# Altium schematic sheet power_supply.SchDoc
size A4; SheetNumber: 3; SheetTotal: 4
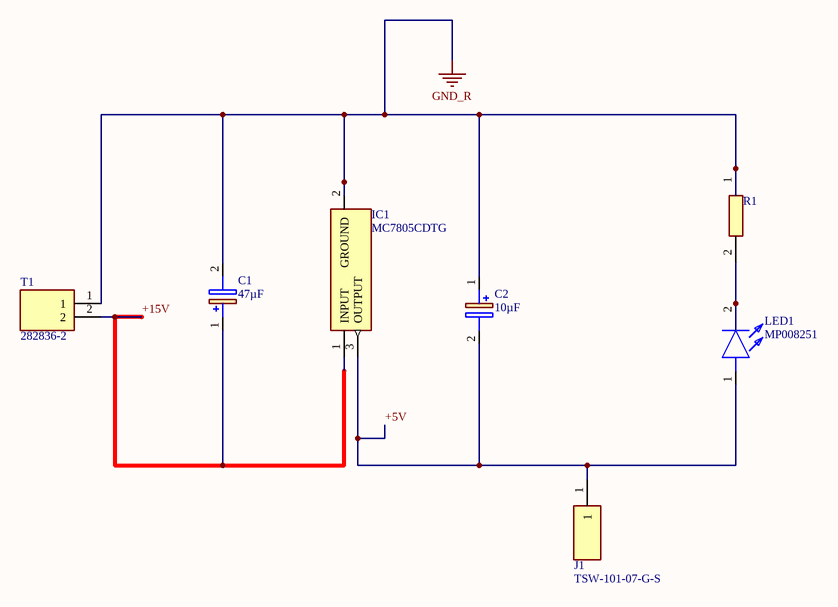
[diagram p0: power_supply.SchDoc]

## Parts
C1  value 47µF  [CAPAE1030X1050N]  (hidden comment: UUX2A470MNL1GS)
C2  value 10µF  [CAPPM6032X280N]  (hidden comment: TPSC106K025R0500)
IC1  MC7805CDTG  [MC7915ACD2TG]
J1  TSW-101-07-G-S  [TSW-101-XX-YY-S]
LED1  MP008251  [SM0603SRC]
R1  CRCW2010100KFKEF  [RESC5025X71N]  (value not drawn)
T1  282836-2  [2828362]

## Nets
GND_R: C1.2(-) C2.1(+) IC1.2(GROUND) R1.1 T1.1
+5V: C2.2(-) IC1.3(OUTPUT) J1.1 LED1.1(A)
+15V: C1.1(+) IC1.1(INPUT) T1.2
NetLED1_2: LED1.2(K) R1.2

## Library data of the parts
C1 = CMP-001-00092-1: Capacitor, Radial / Can - SMD, 47 µF, / 100 V, 2000 hours / @ 105°C, Polar Surface Mount / Tantalum; Manufacturer_Name: Nichicon; Component Type: Standard; Manufacturer_Part_Number: UUX2A470MNL1GS; Arrow Part Number: UUX2A470MNL1GS; Design Item ID: UUX2A470MNL1GS; Height: 10.5mm; Pins: 2; Arrow Price/Stock: https://www.arrow.com/en/products/uux2a470mnl1gs/nichicon; Mouser Part Number: 647-UUX2A470MNL1GS; Mouser Price/Stock: https://www.mouser.co.uk/ProductDetail/Nichicon/UUX2A470MNL1GS?qs=jZZh9D7uMhmPZMofMKn2Fg%3D%3D; Source: Schlib1.SchLib; Datasheet Link: https://componentsearchengine.com/Datasheets/1/UUX2A470MNL1GS.pdf
C2 = CMP-001-00091-1: Capacitor, 10 µF, / 25 V, 2312 [6032 / Metric], ± 10%, 0.5 / ohm, C; Manufacturer_Name: AVX; Pins: 2; Datasheet Link: https://componentsearchengine.com/Datasheets/2/TPSC106K025R0500.pdf; Manufacturer_Part_Number: TPSC106K025R0500; Component Type: Standard; Arrow Part Number: TPSC106K025R0500; Mouser Price/Stock: https://www.mouser.co.uk/ProductDetail/AVX/TPSC106K025R0500?qs=xw8XwkEH2YWjgnPlag1OVw%3D%3D; Design Item ID: TPSC106K025R0500; Arrow Price/Stock: https://www.arrow.com/en/products/tpsc106k025r0500/avx?region=nac; Height: 2.8mm; Source: Schlib1.SchLib; Mouser Part Number: 581-TPSC106K025R0500
IC1 = CMP-031-00039-1: Integrated Circuit; Manufacturer_Name: onsemi; Mouser Part Number: 863-MC7805CDTG; Arrow Price/Stock: https://www.arrow.com/en/products/mc7805cdtg/on-semiconductor?region=europe; Datasheet Link: https://www.onsemi.com/pdf/datasheet/mc7800-d.pdf; Source: RIL_SCH.SchLib; Arrow Part Number: MC7805CDTG; Mouser Price/Stock: https://www.mouser.co.uk/ProductDetail/onsemi/MC7805CDTG?qs=%252B9%2Fcbd0IE0RdeBGvK4GFRg%3D%3D; Manufacturer_Part_Number: MC7805CDTG; Height: 2.51mm; Design Item ID: MC7805CDTG
J1 = CMP-002-00078-1: Connector; Manufacturer_Name: SAMTEC; Arrow Part Number: TSW-101-07-G-S; Arrow Price/Stock: https://www.arrow.com/en/products/tsw-101-07-g-s/samtec?region=europe; Datasheet Link: http://suddendocs.samtec.com/prints/tsw-xxx-xx-xxx-x-xx-xxx-mkt.pdf; Component Type: Standard; Pins: 1; Mouser Price/Stock: https://www.mouser.co.uk/ProductDetail/Samtec/TSW-101-07-G-S?qs=hzq9O0YpnZscfPe5oPvABA%3D%3D; Design Item ID: TSW-101-07-G-S; Manufacturer_Part_Number: TSW-101-07-G-S; Source: Schlib1.SchLib; Mouser Part Number: 200-TSW10107GS
LED1 = CMP-007-00046-1: LED; Pins: 2; Design Item ID: MP008251; Source: Schlib1.SchLib; Component Type: Standard
R1 = CMP-009-00182-1: Resistor; Manufacturer_Name: Vishay; Design Item ID: CRCW2010100KFKEF; Component Type: Standard; Manufacturer_Part_Number: CRCW2010100KFKEF; Mouser Part Number: 71-CRCW2010-100K-E3; Source: Schlib1.SchLib; Pins: 2; Mouser Price/Stock: https://www.mouser.co.uk/ProductDetail/Vishay-Dale/CRCW2010100KFKEF?qs=uSoEc56oFvqZsApDXVXFjw%3D%3D
T1 = CMP-012-00011-1: Connector; Manufacturer_Name: TE Connectivity; Manufacturer_Part_Number: 282836-2; Datasheet Link: https://www.te.com/commerce/DocumentDelivery/DDEController?Action=showdoc&DocId=Customer+Drawing%7F282836%7FJ%7Fpdf%7FEnglish%7FENG_CD_282836_J.pdf%7F282836-2; Source: Schlib1.SchLib; Component Type: Standard; Pins: 2; Height: 10mm; Arrow Part Number: 282836-2; Arrow Price/Stock: https://www.arrow.com/en/products/282836-2/te-connectivity?region=europe; Mouser Part Number: 571-2828362; Design Item ID: 282836-2; Mouser Price/Stock: https://www.mouser.co.uk/ProductDetail/TE-Connectivity/282836-2?qs=A%252Bip%252BNCYi6Ohx9vaQ1l4dg%3D%3D